# EAGLE design TiNRS-Switch-holeshift (EAGLE 7.7.0)
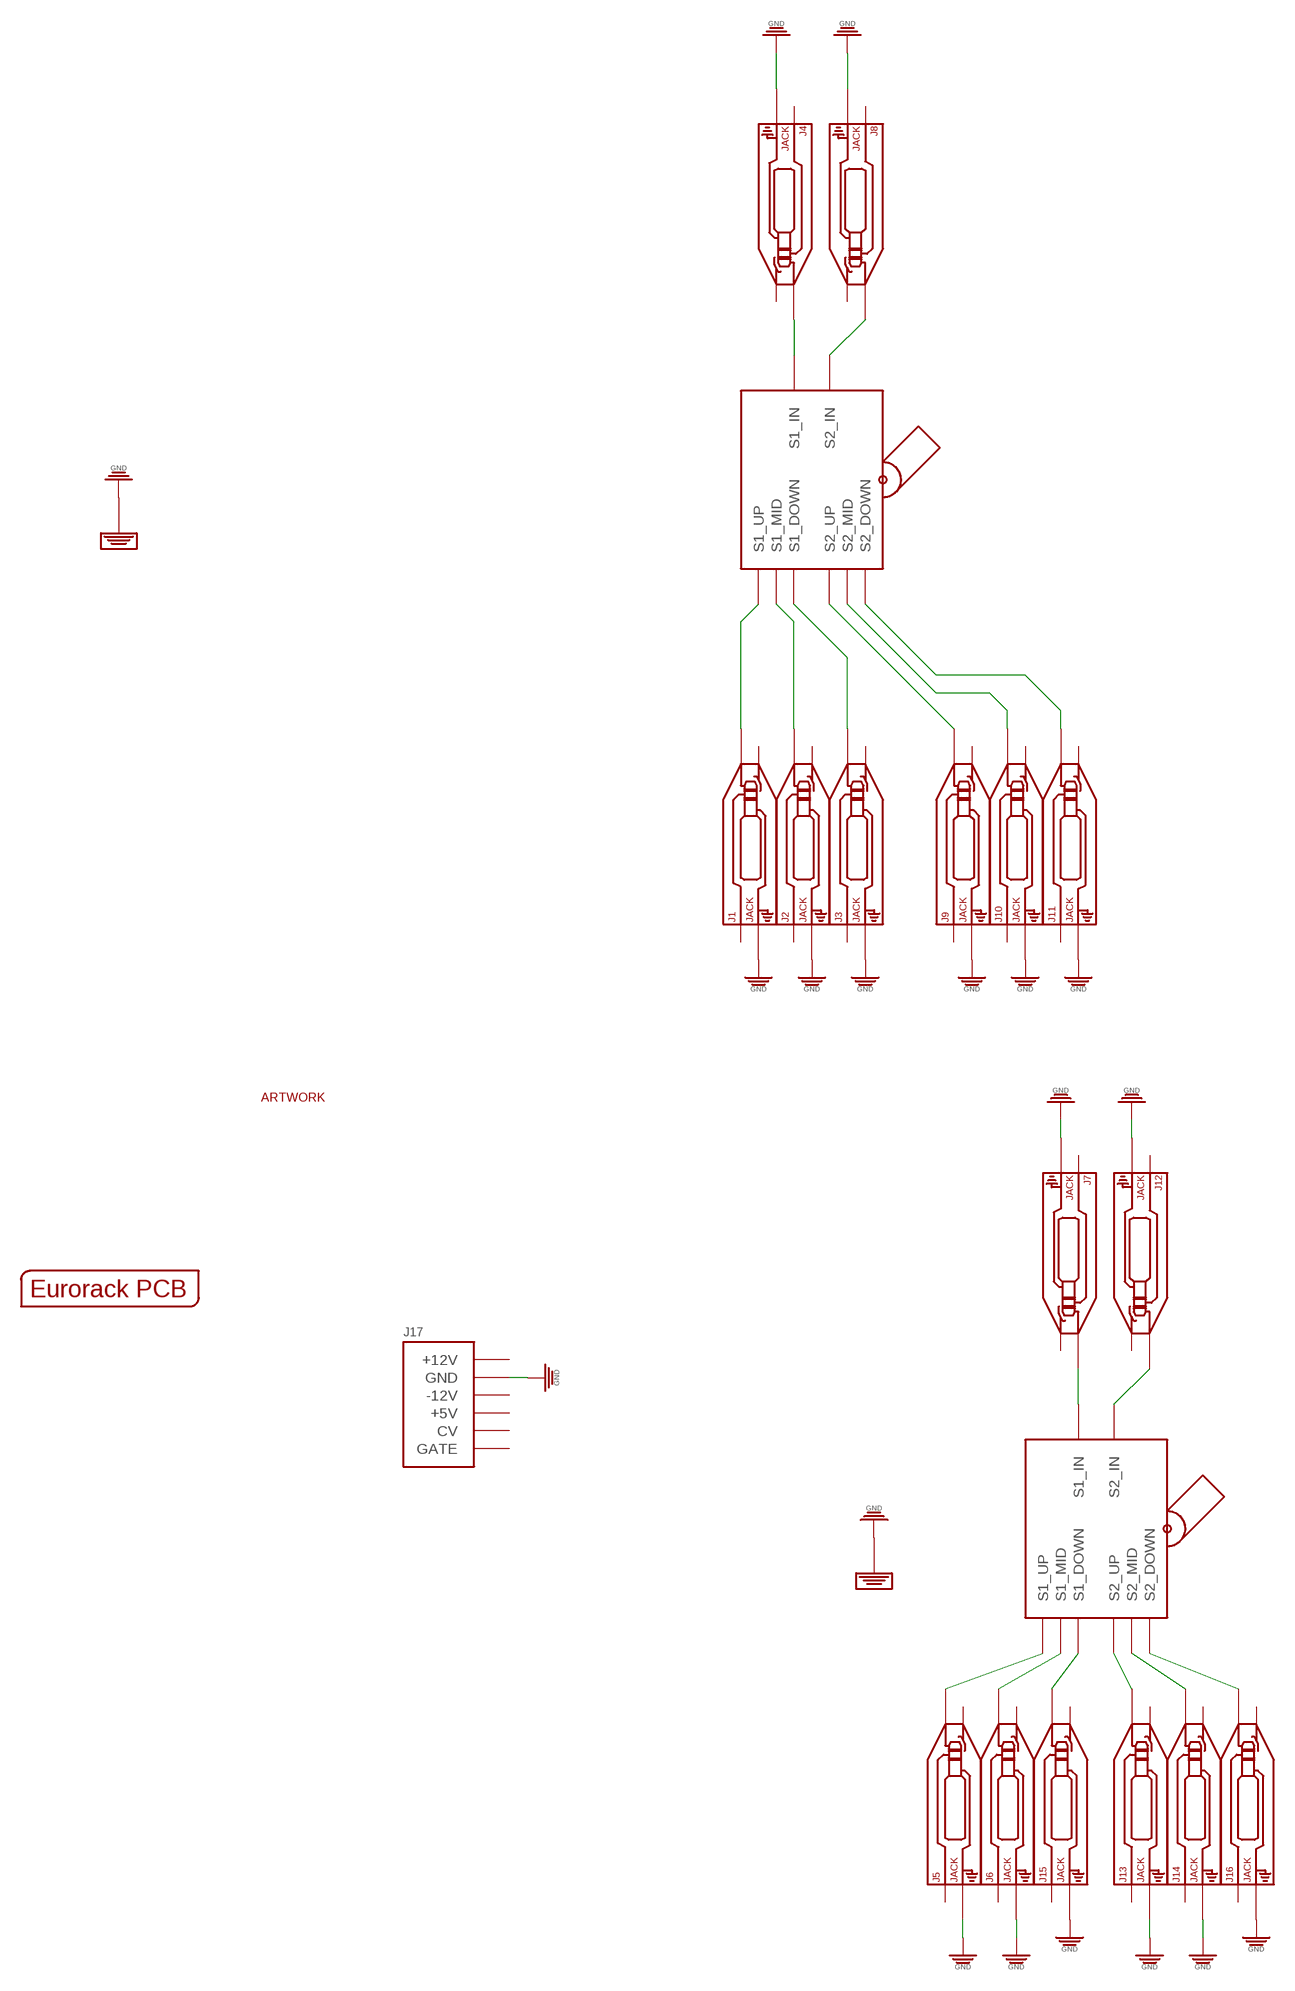
[diagram p0: schematic, sheet 1]

## Parts
J1  JACK  AUDIO-JACK_SMALLSYMBOLNODRILL  [3.5MM-JACK-SWITCH-13MM-NOHOLES]
J2  JACK  AUDIO-JACK_SMALLSYMBOLNODRILL  [3.5MM-JACK-SWITCH-13MM-NOHOLES]
J3  JACK  AUDIO-JACK_SMALLSYMBOLNODRILL  [3.5MM-JACK-SWITCH-13MM-NOHOLES]
J4  JACK  AUDIO-JACK_SMALLSYMBOLNODRILL  [3.5MM-JACK-SWITCH-13MM-NOHOLES]
J5  JACK  AUDIO-JACK_SMALLSYMBOLNODRILL  [3.5MM-JACK-SWITCH-13MM-NOHOLES]
J6  JACK  AUDIO-JACK_SMALLSYMBOLNODRILL  [3.5MM-JACK-SWITCH-13MM-NOHOLES]
J7  JACK  AUDIO-JACK_SMALLSYMBOLNODRILL  [3.5MM-JACK-SWITCH-13MM-NOHOLES]
J8  JACK  AUDIO-JACK_SMALLSYMBOLNODRILL  [3.5MM-JACK-SWITCH-13MM-NOHOLES]
J9  JACK  AUDIO-JACK_SMALLSYMBOLNODRILL  [3.5MM-JACK-SWITCH-13MM-NOHOLES]
J10  JACK  AUDIO-JACK_SMALLSYMBOLNODRILL  [3.5MM-JACK-SWITCH-13MM-NOHOLES]
J11  JACK  AUDIO-JACK_SMALLSYMBOLNODRILL  [3.5MM-JACK-SWITCH-13MM-NOHOLES]
J12  JACK  AUDIO-JACK_SMALLSYMBOLNODRILL  [3.5MM-JACK-SWITCH-13MM-NOHOLES]
J13  JACK  AUDIO-JACK_SMALLSYMBOLNODRILL  [3.5MM-JACK-SWITCH-13MM-NOHOLES]
J14  JACK  AUDIO-JACK_SMALLSYMBOLNODRILL  [3.5MM-JACK-SWITCH-13MM-NOHOLES]
J15  JACK  AUDIO-JACK_SMALLSYMBOLNODRILL  [3.5MM-JACK-SWITCH-13MM-NOHOLES]
J16  JACK  AUDIO-JACK_SMALLSYMBOLNODRILL  [3.5MM-JACK-SWITCH-13MM-NOHOLES]
J17  POWER_SHROUDED_NOTEXT  [POWER_16_SHROUDED_NOTEXT]
PCB1  EURORACK_PCB6HP  [EURORACK6HPPCB]
U$2  TS-23E01  [TS-23E01]
U$4  TINRS_ARTWORKTINYDATE  [JUSTATINYROCKET_DATECODE]
U$5  TS-23E01  [TS-23E01]

## Nets
GND: J1.RING_B@1(RING) J1.RING_T@3(RING) J2.RING_B@1(RING) J2.RING_T@3(RING) J3.RING_B@1(RING) J3.RING_T@3(RING) J4.RING_B@1(RING) J4.RING_T@3(RING) J5.RING_B@1(RING) J5.RING_T@3(RING) J6.RING_B@1(RING) J6.RING_T@3(RING) J7.RING_B@1(RING) J7.RING_T@3(RING) J8.RING_B@1(RING) J8.RING_T@3(RING) J9.RING_B@1(RING) J9.RING_T@3(RING) J10.RING_B@1(RING) J10.RING_T@3(RING) J11.RING_B@1(RING) J11.RING_T@3(RING) J12.RING_B@1(RING) J12.RING_T@3(RING) J13.RING_B@1(RING) J13.RING_T@3(RING) J14.RING_B@1(RING) J14.RING_T@3(RING) J15.RING_B@1(RING) J15.RING_T@3(RING) J16.RING_B@1(RING) J16.RING_T@3(RING) J17.3(GND) J17.4(GND) J17.5(GND) J17.6(GND) J17.7(GND) J17.8(GND) U$2.P$9(GND) U$2.P$10(GND) U$2.P$11(GND) U$2.P$12(GND) U$5.P$9(GND) U$5.P$10(GND) U$5.P$11(GND) U$5.P$12(GND)
N$1: J4.TIP_B@1(TIP) J4.TIP_T@3(TIP) U$2.S1_SRC(S1_IN)
N$2: J8.TIP_B@1(TIP) J8.TIP_T@3(TIP) U$2.S2_SRC(S2_IN)
N$3: J1.TIP_B@1(TIP) J1.TIP_T@3(TIP) U$2.S1_UP
N$4: J2.TIP_B@1(TIP) J2.TIP_T@3(TIP) U$2.S1_MID
N$5: J3.TIP_B@1(TIP) J3.TIP_T@3(TIP) U$2.S1_DOWN
N$6: J9.TIP_B@1(TIP) J9.TIP_T@3(TIP) U$2.S2_UP
N$7: J10.TIP_B@1(TIP) J10.TIP_T@3(TIP) U$2.S2_MID
N$8: J11.TIP_B@1(TIP) J11.TIP_T@3(TIP) U$2.S2_DOWN
N$9: J6.TIP_B@1(TIP) J6.TIP_T@3(TIP) U$5.S1_MID
N$10: J5.TIP_B@1(TIP) J5.TIP_T@3(TIP) U$5.S1_UP
N$11: J7.TIP_B@1(TIP) J7.TIP_T@3(TIP) U$5.S1_SRC(S1_IN)
N$12: J12.TIP_B@1(TIP) J12.TIP_T@3(TIP) U$5.S2_SRC(S2_IN)
N$13: J13.TIP_B@1(TIP) J13.TIP_T@3(TIP) U$5.S2_UP
N$14: J15.TIP_B@1(TIP) J15.TIP_T@3(TIP) U$5.S1_DOWN
N$15: J14.TIP_B@1(TIP) J14.TIP_T@3(TIP) U$5.S2_MID
N$16: J16.TIP_B@1(TIP) J16.TIP_T@3(TIP) U$5.S2_DOWN
Unconnected: J1.SECOND_B@1(SECOND) J1.SECOND_T@3(SECOND) J1.SWITCH_B@1(SWITCH) J1.SWITCH_T@3(SWITCH) J2.SECOND_B@1(SECOND) J2.SECOND_T@3(SECOND) J2.SWITCH_B@1(SWITCH) J2.SWITCH_T@3(SWITCH) J3.SECOND_B@1(SECOND) J3.SECOND_T@3(SECOND) J3.SWITCH_B@1(SWITCH) J3.SWITCH_T@3(SWITCH) J4.SECOND_B@1(SECOND) J4.SECOND_T@3(SECOND) J4.SWITCH_B@1(SWITCH) J4.SWITCH_T@3(SWITCH) J5.SECOND_B@1(SECOND) J5.SECOND_T@3(SECOND) J5.SWITCH_B@1(SWITCH) J5.SWITCH_T@3(SWITCH) J6.SECOND_B@1(SECOND) J6.SECOND_T@3(SECOND) J6.SWITCH_B@1(SWITCH) J6.SWITCH_T@3(SWITCH) J7.SECOND_B@1(SECOND) J7.SECOND_T@3(SECOND) J7.SWITCH_B@1(SWITCH) J7.SWITCH_T@3(SWITCH) J8.SECOND_B@1(SECOND) J8.SECOND_T@3(SECOND) J8.SWITCH_B@1(SWITCH) J8.SWITCH_T@3(SWITCH) J9.SECOND_B@1(SECOND) J9.SECOND_T@3(SECOND) J9.SWITCH_B@1(SWITCH) J9.SWITCH_T@3(SWITCH) J10.SECOND_B@1(SECOND) J10.SECOND_T@3(SECOND) J10.SWITCH_B@1(SWITCH) J10.SWITCH_T@3(SWITCH) J11.SECOND_B@1(SECOND) J11.SECOND_T@3(SECOND) J11.SWITCH_B@1(SWITCH) J11.SWITCH_T@3(SWITCH) J12.SECOND_B@1(SECOND) J12.SECOND_T@3(SECOND) J12.SWITCH_B@1(SWITCH) J12.SWITCH_T@3(SWITCH) J13.SECOND_B@1(SECOND) J13.SECOND_T@3(SECOND) J13.SWITCH_B@1(SWITCH) J13.SWITCH_T@3(SWITCH) J14.SECOND_B@1(SECOND) J14.SECOND_T@3(SECOND) J14.SWITCH_B@1(SWITCH) J14.SWITCH_T@3(SWITCH) J15.SECOND_B@1(SECOND) J15.SECOND_T@3(SECOND) J15.SWITCH_B@1(SWITCH) J15.SWITCH_T@3(SWITCH) J16.SECOND_B@1(SECOND) J16.SECOND_T@3(SECOND) J16.SWITCH_B@1(SWITCH) J16.SWITCH_T@3(SWITCH) J17.1(-12V) J17.2(-12V) J17.9(+12V) J17.10(+12V) J17.11(+5V) J17.12(+5V) J17.13(CV) J17.14(CV) J17.15(GATE) J17.16(GATE)

## Library data of the parts
J1 = EurorackModularParts:AUDIO-JACK_SMALLSYMBOL: Switching Mono 3.5mm Audio Jack from Erthenvar.; DESC: 1 A
J2 = EurorackModularParts:AUDIO-JACK_SMALLSYMBOL: Switching Mono 3.5mm Audio Jack from Erthenvar.; DESC: 1 B
J3 = EurorackModularParts:AUDIO-JACK_SMALLSYMBOL: Switching Mono 3.5mm Audio Jack from Erthenvar.; DESC: 1 C
J4 = EurorackModularParts:AUDIO-JACK_SMALLSYMBOL: Switching Mono 3.5mm Audio Jack from Erthenvar.; DESC: 1
J5 = EurorackModularParts:AUDIO-JACK_SMALLSYMBOL: Switching Mono 3.5mm Audio Jack from Erthenvar.; DESC: 3 A
J6 = EurorackModularParts:AUDIO-JACK_SMALLSYMBOL: Switching Mono 3.5mm Audio Jack from Erthenvar.; DESC: 3 B
J7 = EurorackModularParts:AUDIO-JACK_SMALLSYMBOL: Switching Mono 3.5mm Audio Jack from Erthenvar.; DESC: 3
J8 = EurorackModularParts:AUDIO-JACK_SMALLSYMBOL: Switching Mono 3.5mm Audio Jack from Erthenvar.; DESC: 2
J9 = EurorackModularParts:AUDIO-JACK_SMALLSYMBOL: Switching Mono 3.5mm Audio Jack from Erthenvar.; DESC: 2 A
J10 = EurorackModularParts:AUDIO-JACK_SMALLSYMBOL: Switching Mono 3.5mm Audio Jack from Erthenvar.; DESC: 2 B
J11 = EurorackModularParts:AUDIO-JACK_SMALLSYMBOL: Switching Mono 3.5mm Audio Jack from Erthenvar.; DESC: 2 C
J12 = EurorackModularParts:AUDIO-JACK_SMALLSYMBOL: Switching Mono 3.5mm Audio Jack from Erthenvar.; DESC: 4
J13 = EurorackModularParts:AUDIO-JACK_SMALLSYMBOL: Switching Mono 3.5mm Audio Jack from Erthenvar.; DESC: 4 A
J14 = EurorackModularParts:AUDIO-JACK_SMALLSYMBOL: Switching Mono 3.5mm Audio Jack from Erthenvar.; DESC: 4 B
J15 = EurorackModularParts:AUDIO-JACK_SMALLSYMBOL: Switching Mono 3.5mm Audio Jack from Erthenvar.; DESC: 3 C
J16 = EurorackModularParts:AUDIO-JACK_SMALLSYMBOL: Switching Mono 3.5mm Audio Jack from Erthenvar.; DESC: 4 C
J17 = EurorackModularParts:POWER
PCB1 = EurorackModularParts:EURORACK_PCB
U$2 U$5 = FenixBase:TS-23E01; DESC: Toggle; DOWN: 3; MID: 2; UP: 1
U$4 = EurorackModularParts:TINRS_ARTWORK

## Net classes
0 default: width 0.381 mm

## Board
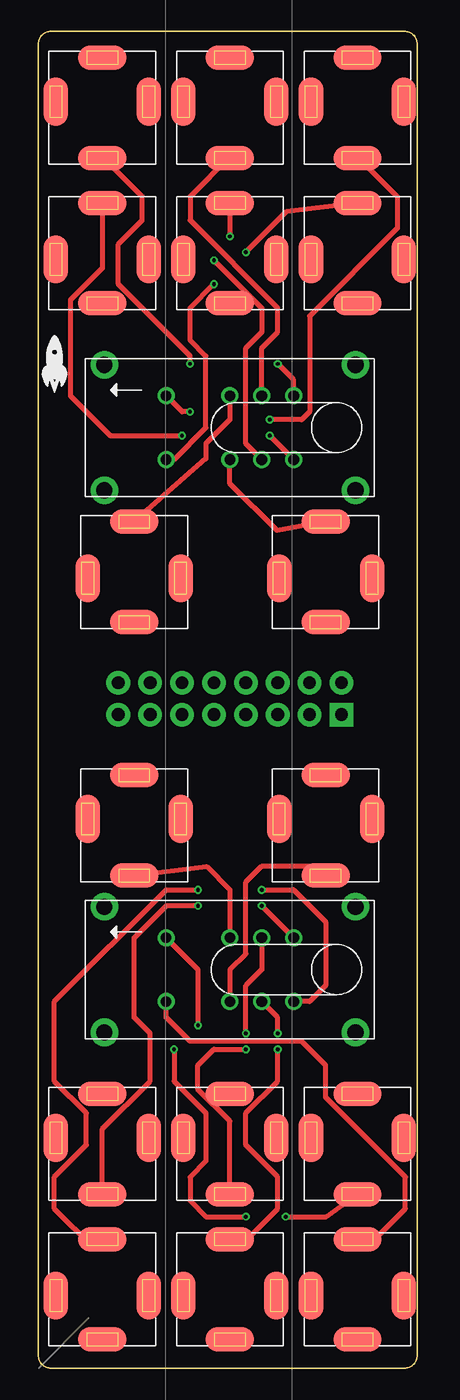
[diagram p1: board, top side]
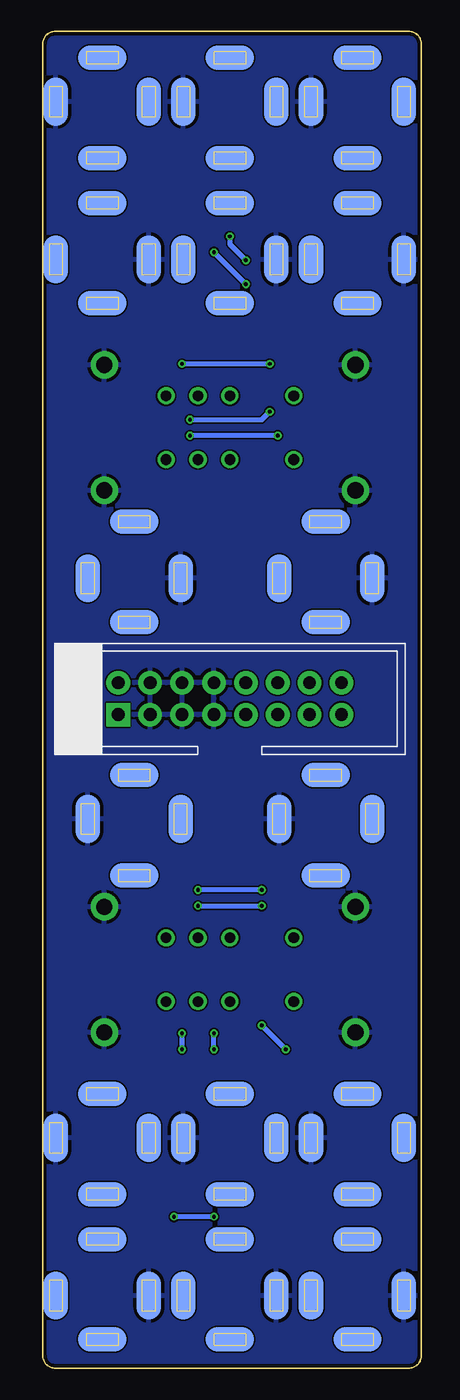
[diagram p2: board, bottom side, seen from below]

Size 30.16 x 106.5 mm. Coordinates in mm from the lower left corner, seen from the top.
Copper layers (1*16): Top 0.035mm / dielectric 1.5mm / Bottom 0.035mm
Design rules "dirt_cheap_dirty_boards.v1": minimum track width 5mil, minimum drill 12mil, track to track 5mil, track to pad 5mil, pad to pad 5mil, via to via 5mil, smd to smd 0mil, copper to edge 10mil, drill to drill 10mil, minimum pad ring 10mil, minimum via ring 6mil, stop-mask expansion 2mil, vias tented up to drill 25mil, thermal gap 10mil

### Footprints (pad centres in the part's own frame; a part is rotated, then mirrored left to right if it is on the bottom)
3.5MM-JACK-SWITCH-13MM-NOHOLES = smd 1.95 x 3.85 bottom: RING_B@1 -3.7,0; SWITCH_B@1 3.7,0 | smd 1.95 x 3.85: RING_T@3 -3.7,0; SWITCH_T@3 3.7,0 | smd 3.85 x 1.95 bottom: SECOND_B@1 0,-3.5; TIP_B@1 0,4.5 | smd 3.85 x 1.95: SECOND_T@3 0,-3.5; TIP_T@3 0,4.5
POWER_16_SHROUDED_NOTEXT = drill 1.016 pad 1.88 square: 1 -8.89,-1.27 | drill 1.016 pad 1.88: 2 -8.89,1.27; 3 -6.35,-1.27; 4 -6.35,1.27; 5 -3.81,-1.27; 6 -3.81,1.27; 7 -1.27,-1.27; 8 -1.27,1.27; 9 1.27,-1.27; 10 1.27,1.27; 11 3.81,-1.27; 12 3.81,1.27; 13 6.35,-1.27; 14 6.35,1.27; 15 8.89,-1.27; 16 8.89,1.27
TS-23E01 = drill 1.3 pad 2.2: P$9 -10,5; P$10 -10,-5; P$11 10,5; P$12 10,-5 | drill 0.85: S1_DOWN -5.08,2.54; S1_MID 2.54,2.54; S1_SRC 0,2.54; S1_UP 5.08,2.54; S2_DOWN -5.08,-2.54; S2_MID 2.54,-2.54; S2_SRC 0,-2.54; S2_UP 5.08,-2.54

### Placement (x,y rotation side)
J1  5.09,100.9 180 top
J2  15.25,100.9 180 top
J3  25.41,100.9 180 top
J4  7.63,62.93 0 top
J5  5.09,18.35 180 top
J6  15.25,18.35 180 top
J7  7.63,43.75 180 top
J8  22.87,62.93 0 top
J9  5.09,88.33 0 top
J10  15.25,88.33 0 top
J11  25.41,88.33 0 top
J12  22.87,43.75 180 top
J13  5.09,5.78 0 top
J14  15.25,5.78 0 top
J15  25.41,18.35 180 top
J16  25.41,5.78 0 top
J17  15.25,53.34 0 bottom
PCB1  0.01,0 0 top
U$2  15.25,74.93 0 top
U$4  1.28,80.01 0 top
U$5  15.25,31.75 0 top

### Tracks (layer width: path | path; a pad name or v marks a point on that pad's centre or on a via)
GND
  pour Bottom: -2.53,109.22 38.11,109.22 38.11,-7.62 -2.53,-7.62
N$1
  Top 0.381: U$2.S1_SRC 15.25,75.56 13.34,73.66 13.34,72.44 J4.TIP_B@1
N$2
  Top 0.381: J8.TIP_B@1 19,66.73 15.25,70.48 U$2.S2_SRC
N$3  (via drill 0.3)
  Top 0.381: J1.TIP_B@1 5.09,96.52 8.26,93.34 8.26,91.44 6.36,89.53 6.36,86.36 12.07,80.64 v12.07,80.01 | U$2.S1_UP 20.33,78.74 v19.06,80.01
  Bottom 0.381: v19.06,80.01 v12.07,80.01
N$4
  Top 0.381: J2.TIP_B@1 15.25,96.52 12.07,93.34 12.07,91.44 19.06,84.45 19.06,82.55 17.79,81.28 U$2.S1_MID
N$5  (via drill 0.3)
  Top 0.381: J3.TIP_B@1 25.41,96.52 28.58,93.34 28.58,90.81 21.6,83.82 21.6,76.2 20.96,75.56 v18.42,75.56 | v12.07,76.2 11.44,76.2 U$2.S1_DOWN
  Bottom 0.381: v18.42,75.56 12.71,75.56 v12.07,76.2
N$6  (via drill 0.3)
  Top 0.381: J9.TIP_B@1 5.09,87.63 2.55,85.09 2.55,77.47 5.72,74.3 v11.44,74.3 | v18.42,74.3 U$2.S2_UP
  Bottom 0.381: v11.44,74.3 v18.42,74.3
N$7  (via drill 0.3)
  Top 0.381: U$2.S2_MID 16.52,73.66 16.52,81.28 17.79,82.55 17.79,84.45 v13.98,88.27 | J10.TIP_B@1 v15.25,90.17
  Bottom 0.381: v15.25,90.17 15.25,89.53 v13.98,88.27
N$8  (via drill 0.3)
  Top 0.381: U$2.S2_DOWN 10.8,72.39 13.34,74.93 13.34,80.64 12.07,81.92 12.07,84.45 v13.98,86.36 | J11.TIP_B@1 19.75,92.13 v16.52,88.9
  Bottom 0.381: v16.52,88.9 v13.98,86.36
N$9  (via drill 0.3)
  Top 0.381: U$5.S1_MID 17.79,31.75 16.52,30.48 v16.52,26.67 | J6.TIP_B@1 15.25,19.68 12.71,22.23 12.71,24.13 13.98,25.4 v16.52,25.4
  Bottom 0.381: v16.52,25.4 v16.52,26.67
N$10  (via drill 0.3)
  Top 0.381: U$5.S1_UP v17.79,36.83 | v12.71,36.83 10.17,36.83 7.63,34.29 7.63,27.94 8.9,26.67 8.9,22.86 5.09,19.05 J5.TIP_B@1
  Bottom 0.381: v17.79,36.83 v12.71,36.83
N$11
  Top 0.381: J7.TIP_B@1 13.4,39.95 15.25,38.1 U$5.S1_SRC
N$12
  Top 0.381: U$5.S2_SRC 15.25,31.75 16.52,33.02 16.52,38.73 17.79,40.01 22.81,40.01 J12.TIP_B@1
N$13  (via drill 0.3)
  Top 0.381: J13.TIP_B@1 4.4,9.58 1.28,12.7 1.28,15.24 3.82,17.78 3.82,20.32 1.28,22.86 1.28,29.21 10.17,38.1 v12.71,38.1 | v17.79,38.1 20.33,38.1 22.87,35.56 22.87,30.48 21.6,29.21 U$5.S2_UP
  Bottom 0.381: v12.71,38.1 v17.79,38.1
N$14  (via drill 0.3)
  Top 0.381: U$5.S1_DOWN 12.71,31.75 v12.71,27.3 | v10.8,25.4 10.8,22.86 13.34,20.32 13.34,16.51 12.07,15.24 12.07,13.34 13.34,12.06 v16.52,12.06 | v19.69,12.06 22.92,12.06 J15.TIP_B@1
  Bottom 0.381: v12.71,27.3 v10.8,25.4 | v16.52,12.06 v19.69,12.06
N$15  (via drill 0.3)
  Top 0.381: J14.TIP_B@1 15.94,9.58 19.06,12.7 19.06,15.24 16.52,17.78 16.52,20.32 19.06,22.86 v19.06,25.4 | v19.06,26.67 19.06,27.94 U$5.S2_MID
  Bottom 0.381: v19.06,25.4 v19.06,26.67
N$16
  Top 0.381: J16.TIP_B@1 26.1,9.58 29.22,12.7 29.22,15.24 22.87,21.59 22.87,24.13 20.96,26.04 12.07,26.04 10.17,27.94 U$5.S2_DOWN